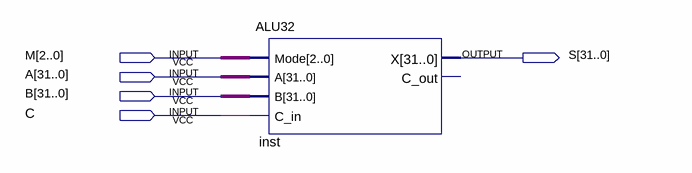
[diagram p0: schematic sheet]
// Quartus schematic verilog-alu-qupj-block.bdf as structural Verilog: 1 symbols, 5 pins
module \verilog-alu-qupj-block  (
  input  [2:0] M,
  input  [31:0] A,
  input  [31:0] B,
  input  C,
  output [31:0] S
);

  ALU32 inst (.Mode(M), .A(A), .B(B), .C_in(C), .X(S));  // open: C_out
endmodule
